# EAGLE design Triple Socket (EAGLE 8.4.0)
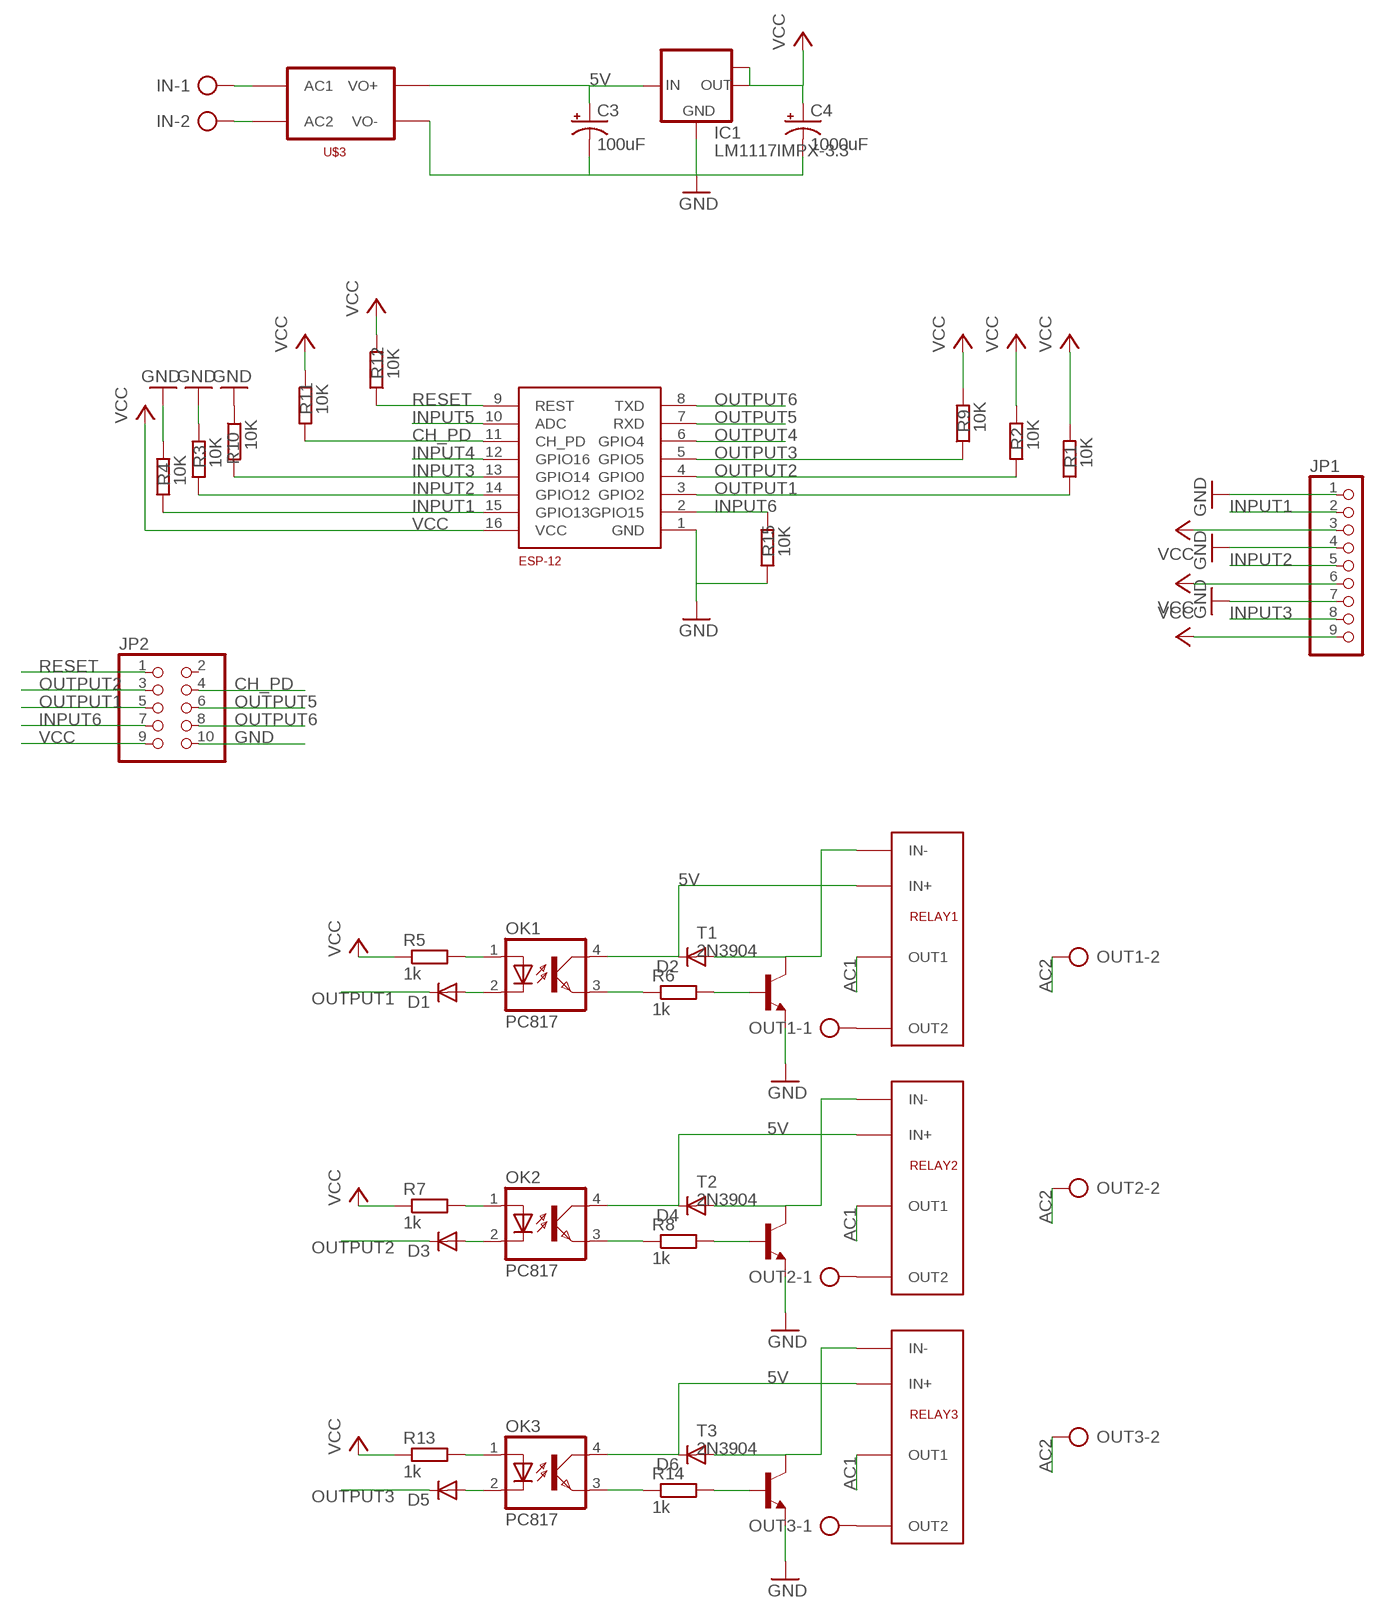
[diagram p0: schematic, sheet 1]

## Parts
C3  100uF  CPOL-USE5-10.5  [E5-10,5]
C4  1000uF  CPOL-USE5-10.5  [E5-10,5]
D1  DIODE-SOD80C  [SOD80C]
D2  DIODE-SOD80C  [SOD80C]
D3  DIODE-SOD80C  [SOD80C]
D4  DIODE-SOD80C  [SOD80C]
D5  DIODE-SOD80C  [SOD80C]
D6  DIODE-SOD80C  [SOD80C]
ESP-12  ESP8266_ESP-12  [ESP8266-ESP12]
IC1  LM1117IMPX-3.3  [SOT223]
IN  AK500/2-H  [AK500/2-H]
JP1  PINHD-1X9  [1X09]
JP2  PINHD-2X5  [2X05]
OK1  PC817  [DIL04]
OK2  PC817  [DIL04]
OK3  PC817  [DIL04]
OUT1  AK500/2-H  [AK500/2-H]
OUT2  AK500/2-H  [AK500/2-H]
OUT3  AK500/2-H  [AK500/2-H]
R1  10K  R-EU_R0805  [R0805]
R2  10K  R-EU_R0805  [R0805]
R3  10K  R-EU_R0805  [R0805]
R4  10K  R-EU_R0805  [R0805]
R5  1k  R-EU_R0805  [R0805]
R6  1k  R-EU_R0805  [R0805]
R7  1k  R-EU_R0805  [R0805]
R8  1k  R-EU_R0805  [R0805]
R9  10K  R-EU_R0805  [R0805]
R10  10K  R-EU_R0805  [R0805]
R11  10K  R-EU_R0805  [R0805]
R12  10K  R-EU_R0805  [R0805]
R13  1k  R-EU_R0805  [R0805]
R14  1k  R-EU_R0805  [R0805]
R15  10K  R-EU_R0805  [R0805]
RELAY1  G3MB-202P  [G3MB-202P]
RELAY2  G3MB-202P  [G3MB-202P]
RELAY3  G3MB-202P  [G3MB-202P]
T1  2N3904  [TO92]
T2  2N3904  [TO92]
T3  2N3904  [TO92]
U$3  HLK-PM01  [HLK-PM01]

## Nets
5V [Power]: C3.+ D2.C D4.C D6.C IC1.3(IN) OK1.4(COL) OK2.4(COL) OK3.4(COL) RELAY1.IN+ RELAY2.IN+ RELAY3.IN+ U$3.VO+
AC1 [AC]: IN.1 RELAY1.OUT1 RELAY2.OUT1 RELAY3.OUT1 U$3.AC1
AC2 [AC]: IN.2 OUT1.2 OUT2.2 OUT3.2 U$3.AC2
CH_PD: ESP-12.11(CH_PD) JP2.4 R11.1
GND [Power]: C3.- C4.- ESP-12.1(GND) IC1.1(GND) JP1.1 JP1.4 JP1.7 JP2.10 R3.1 R4.2 R10.1 R15.1 T1.3(E) T2.3(E) T3.3(E) U$3.VO-
INPUT1: ESP-12.15(GPIO13) JP1.2 R4.1
INPUT2: ESP-12.14(GPIO12) JP1.5 R3.2
INPUT3: ESP-12.13(GPIO14) JP1.8 R10.2
INPUT4: ESP-12.12(GPIO16)
INPUT5: ESP-12.10(ADC)
INPUT6: ESP-12.2(GPIO15) JP2.7 R15.2
N$1: OUT2.1 RELAY2.OUT2
N$3: R14.2 T3.2(B)
N$4: D6.A RELAY3.IN- T3.1(C)
N$5: OUT1.1 RELAY1.OUT2
N$6: OUT3.1 RELAY3.OUT2
N$7: R6.2 T1.2(B)
N$8: D2.A RELAY1.IN- T1.1(C)
N$12: R8.2 T2.2(B)
N$13: D4.A RELAY2.IN- T2.1(C)
OPT_EMITTER1: OK1.3(EMIT) R6.1
OPT_EMITTER3: OK3.3(EMIT) R14.1
OPT_LED-1: D1.A OK1.2(C)
OPT_LED-3: D5.A OK3.2(C)
OPTO_EMITTER2: OK2.3(EMIT) R8.1
OPTO_LED+1: OK1.1(A) R5.2
OPTO_LED+2: OK2.1(A) R7.2
OPTO_LED+3: OK3.1(A) R13.2
OPTO_LED-2: D3.A OK2.2(C)
OUTPUT1: D1.C ESP-12.3(GPIO2) JP2.5 R1.1
OUTPUT2: D3.C ESP-12.4(GPIO0) JP2.3 R2.1
OUTPUT3: D5.C ESP-12.5(GPIO5) R9.1
OUTPUT4: ESP-12.6(GPIO4)
OUTPUT5: ESP-12.7(RXD) JP2.6
OUTPUT6: ESP-12.8(TXD) JP2.8
RESET: ESP-12.9(REST) JP2.1 R12.1
VCC [Power]: C4.+ ESP-12.16(VCC) IC1.2(OUT) IC1.TAB(OUT1) JP1.3 JP1.6 JP1.9 JP2.9 R1.2 R2.2 R5.1 R7.1 R9.2 R11.2 R12.2 R13.1
Unconnected: JP2.2

## Library data of the parts
C3 C4 = rcl:CPOL-US: POLARIZED CAPACITOR, American symbol
D1-D6 = diode:DIODE-: DIODE
ESP-12 = ESP8266-ESP12:ESP8266_ESP-12
IC1 = lm1117:LM1117IMPX-*
IN OUT1-OUT3 = con-ptr500:AK500/2-H: CONNECTOR Aug. 2004 / PTR Meßtechnik: Die Bezeichnung der Serie AK505 wurde geändert. Es handelt sich hierbei um AK500 in horizontaler Ausführung.
JP1 = pinhead:PINHD-1X9: PIN HEADER
JP2 = pinhead:PINHD-2X5: PIN HEADER
OK1-OK3 = optocoupler:PC817: SHARP OPTO COUPLER; MPN: PC817X4J000F; OC_FARNELL: 9707727; OC_NEWARK: 97K7059
R1-R15 = rcl:R-EU_: RESISTOR, European symbol
RELAY1-RELAY3 = AndreBotelho:G3MB-202P
T1-T3 = transistor:2N3904: NPN TRANSISTOR
U$3 = AndreBotelho:HLK-PM01

## Net classes
0 default: width 0.203 mm, drill 0.381 mm, clearance 0.152 mm
1 Power: width 0.254 mm, drill 0.381 mm, clearance 0.152 mm
2 AC: width 2.286 mm, drill 1.016 mm, clearance 0.305 mm

## Board
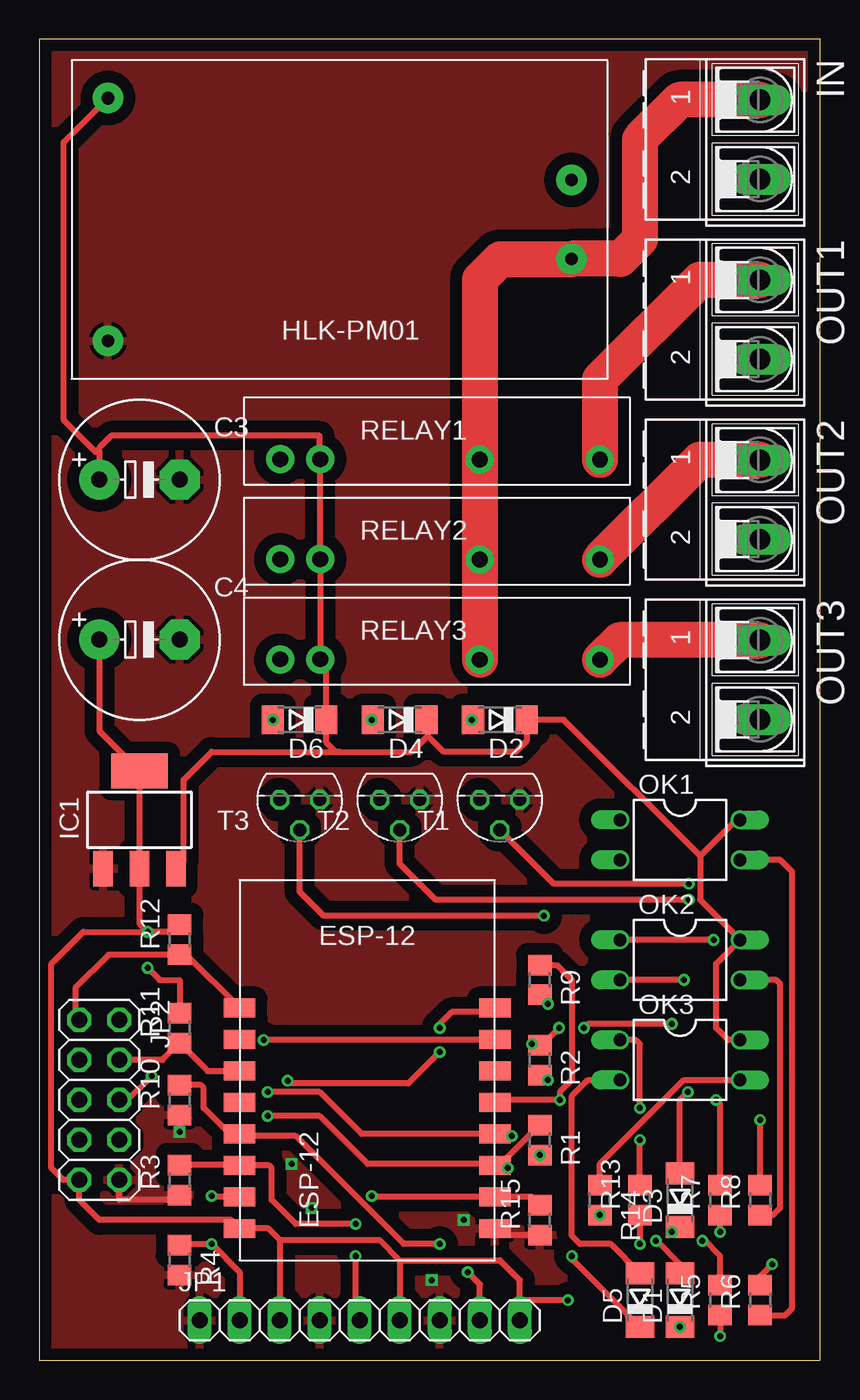
[diagram p1: board, top side]
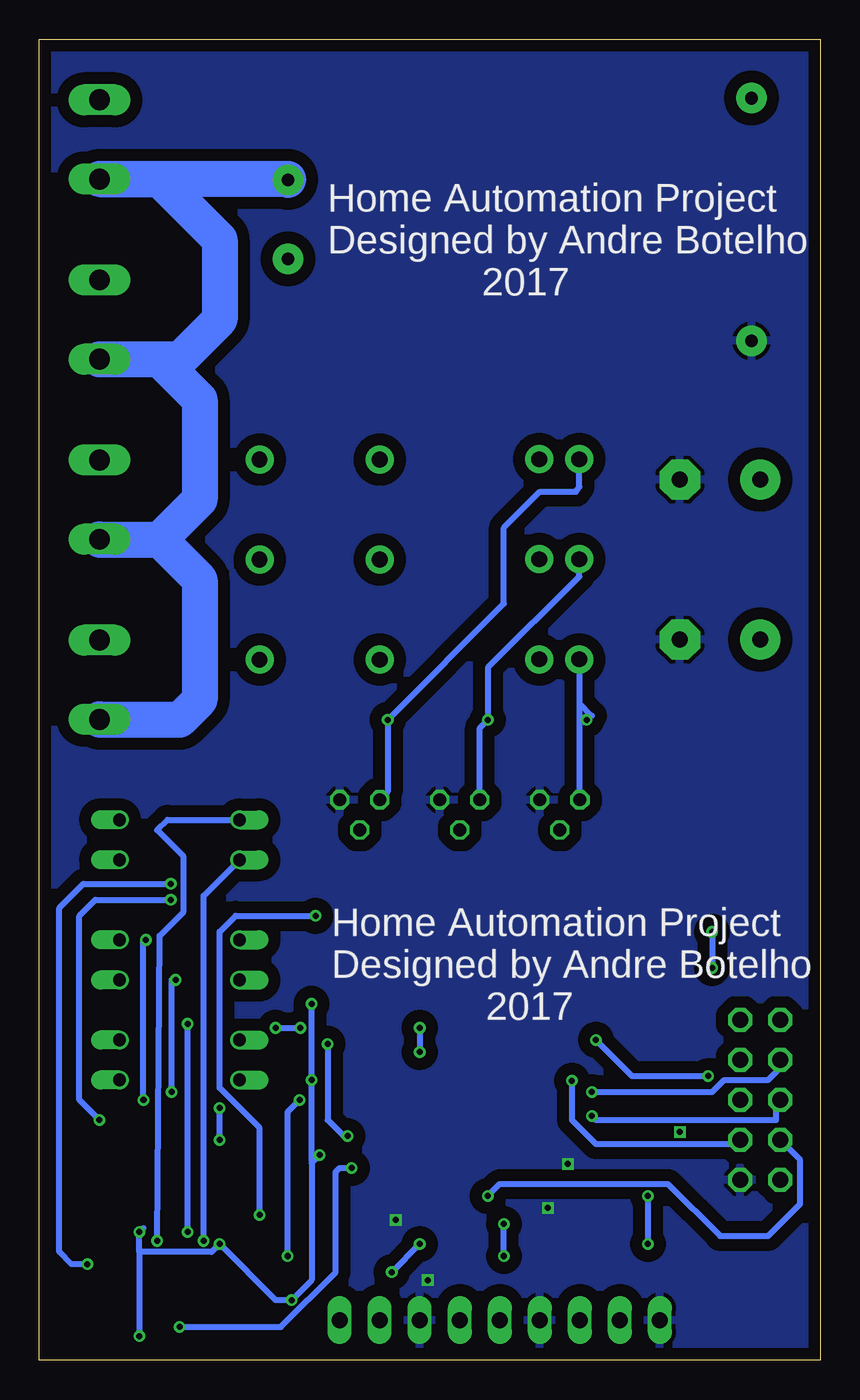
[diagram p2: board, bottom side, seen from below]

Size 49.53 x 83.82 mm. Coordinates in mm from the lower left corner, seen from the top.
Outline: 0,0 49.53,0 49.53,83.82 0,83.82 0,0
Copper layers (1*16): Top 0.0356mm / dielectric 1.5011mm / Bottom 0.0356mm
Design rules "oshpark-2layer": minimum track width 6mil, minimum drill 13mil, track to track 6mil, track to pad 6mil, pad to pad 6mil, via to via 6mil, smd to smd 6mil, copper to edge 15mil, drill to drill 6mil, minimum pad ring 7mil, minimum via ring 7mil, stop-mask expansion 2.5mil, vias tented up to drill 0mil, thermal gap 10mil

### Footprints (pad centres in the part's own frame; a part is rotated, then mirrored left to right if it is on the bottom)
E5-10,5 = drill 1.016 pad 2.54: + -2.54,0 | drill 1.016 pad 2.54 octagon: - 2.54,0
SOD80C = smd 1.4 x 1.8: A 1.7,0; C -1.7,0
ESP8266-ESP12 = smd 2 x 1.2: 1 8.58,-9.43; 2 8.58,-7.43; 3 8.58,-5.43; 4 8.58,-3.43; 5 8.58,-1.43; 6 8.58,0.57; 7 8.58,2.57; 8 8.58,4.57; 9 -7.62,4.57; 10 -7.62,2.57; 11 -7.62,0.57; 12 -7.62,-1.43; 13 -7.62,-3.43; 14 -7.62,-5.43; 15 -7.62,-7.43; 16 -7.62,-9.43
SOT223 = smd 1.219 x 2.235: 1 -2.311,-3.099; 2 0,-3.099; 3 2.311,-3.099 | smd 3.6 x 2.2: TAB 0,3.099
AK500/2-H = drill 1.321 long: 1 -2.515,0; 2 2.515,0
1X09 = drill 1.016 long: 1 -10.16,0; 2 -7.62,0; 3 -5.08,0; 4 -2.54,0; 5 0,0; 6 2.54,0; 7 5.08,0; 8 7.62,0; 9 10.16,0
2X05 = drill 1.016 octagon: 1 -5.08,-1.27; 2 -5.08,1.27; 3 -2.54,-1.27; 4 -2.54,1.27; 5 0,-1.27; 6 0,1.27; 7 2.54,-1.27; 8 2.54,1.27; 9 5.08,-1.27; 10 5.08,1.27
DIL04 = drill 0.813 offset: 1 -1.27,-3.81; 2 1.27,-3.81; 3 1.27,3.81; 4 -1.27,3.81
R0805 = smd 1.3 x 1.5: 1 -0.95,0; 2 0.95,0
G3MB-202P = drill 1 pad 1.778: IN+ -6.311,-1.245; IN- -8.851,-1.245; OUT1 3.81,-1.27; OUT2 11.43,-1.27
TO92 = drill 0.813 octagon: 1 1.27,0; 2 0,1.905; 3 -1.27,0
HLK-PM01 = drill 0.8 pad 1.93: AC1 -14.7,2.5; AC2 -14.7,-2.5; VO+ 14.7,-7.7; VO- 14.7,7.7

### Placement (x,y rotation side)
C3  6.35,55.88 0 top
C4  6.35,45.72 0 top
D1  40.64,3.81 90 top
D2  29.21,40.64 180 top
D3  40.64,10.16 90 top
D4  22.86,40.64 180 top
D5  38.1,3.81 90 top
D6  16.51,40.64 180 top
ESP-12  20.32,17.78 0 top
IC1  6.35,34.29 0 top
IN  45.72,77.47 270 top
JP1  20.32,2.54 0 top
JP2  3.81,16.51 270 top
OK1  40.64,33.02 270 top
OK2  40.64,25.4 270 top
OK3  40.64,19.05 270 top
OUT1  45.72,66.04 270 top
OUT2  45.72,54.61 270 top
OUT3  45.72,43.18 270 top
R1  31.75,13.97 270 top
R2  31.75,19.05 270 top
R3  8.89,11.43 90 top
R4  8.89,6.35 270 top
R5  43.18,3.81 90 top
R6  45.72,3.81 90 top
R7  43.18,10.16 90 top
R8  45.72,10.16 90 top
R9  31.75,24.13 270 top
R10  8.89,16.51 90 top
R11  8.89,21.08 90 top
R12  8.89,26.67 90 top
R13  38.1,10.16 90 top
R14  35.56,10.16 270 top
R15  31.75,8.89 90 top
RELAY1  24.13,58.42 0 top
RELAY2  24.13,52.07 0 top
RELAY3  24.13,45.72 0 top
T1  29.21,35.56 180 top
T2  22.86,35.56 180 top
T3  16.51,35.56 180 top
U$3  19.05,72.39 180 top

### Tracks (layer width: path | path; a pad name or v marks a point on that pad's centre or on a via)
5V
  Top 0.381: OK3.4 43.69,20.32 42.93,21.08 42.93,25.15 OK2.4 41.91,29.21 41.91,32 | OK1.4 44.2,34.29 41.91,32 | 41.91,32 33.27,40.64 D2.C 30.91,39.29 30.23,38.61 25.65,38.61 24.64,39.62 | D4.C 24.64,40.56 24.64,39.62 | 24.64,39.62 23.62,38.61 19.05,38.61 | 19.05,38.61 18.8,38.61 18.21,39.19 D6.C 18.21,44.09 RELAY3.IN+ 17.82,50.55 | 17.82,50.55 RELAY2.IN+ | 17.82,50.55 RELAY1.IN+ 17.78,57.22 17.78,58.67 4.57,58.67 3.81,57.91 3.81,57.66 | 3.81,57.66 C3.+ | U$3.VO+ 1.52,77.26 1.52,59.69 3.56,57.66 3.81,57.66 | IC1.3 9.14,31.67 9.14,36.83 10.92,38.61 19.05,38.61
AC1
  Top 2.286: IN.1 40.62,79.98 38.1,77.47 38.1,71.12 36.87,69.89 U$3.AC1 33.71,69.85 29.21,69.85 27.94,68.58 RELAY1.OUT1 RELAY2.OUT1 RELAY3.OUT1
AC2
  Bottom 2.286: U$3.AC2 33.75,74.95 IN.2 41.94,74.95 38.1,71.12 38.1,66.04 40.64,63.5 45.72,63.5 OUT1.2 41.94,63.52 39.37,60.96 39.37,54.61 41.91,52.07 | OUT2.2 45.7,52.07 41.91,52.07 | 41.91,52.07 39.37,49.53 39.37,41.91 40.64,40.64 45.7,40.64 OUT3.2
CH_PD
  Top 0.381: JP2.4 7.81,19.05 R11.1 10.67,18.35 ESP-12.11
GND  (via drill 0.38)
  Top 0.381: ESP-12.1 29.31,7.94 R15.1 | R3.1 8.57,10.16 5.08,10.16 JP2.10 | R10.1 v8.89,14.48
  other vias: 16,12.45 17.27,9.65 24.89,5.08 26.92,8.89
  pour Top (isolate 0.762): 0,0 0,83.82 49.53,83.82 49.53,0
  pour Bottom (isolate 0.762): 0,0 0,83.82 49.53,83.82 49.53,0
INPUT1  (via drill 0.38)
  Top 0.381: ESP-12.15 10.99,10.35 v10.92,10.41 | R4.1 8.96,7.37 v10.92,7.37 12.7,5.59 JP1.2
  Bottom 0.381: v10.92,10.41 v10.92,7.37
INPUT2  (via drill 0.38)
  Top 0.381: JP1.5 20.07,2.79 v20.07,6.6 | v20.07,8.64 16.26,8.64 14.73,10.16 14.73,12.19 14.57,12.35 ESP-12.14 12.67,12.38 R3.2
  Bottom 0.381: v20.07,6.6 v20.07,8.64
INPUT3  (via drill 0.38)
  Top 0.381: R10.2 10.23,17.46 10.41,17.27 10.41,16 12.07,14.35 ESP-12.13 13.08,14.35 13.21,14.22 16.26,14.22 23.11,7.37 v25.4,7.37 | JP1.8 27.94,4.83 v27.18,5.59
  Bottom 0.381: v27.18,5.59 v25.4,7.37
INPUT6  (via drill 0.38)
  Top 0.381: R15.2 31.24,10.35 ESP-12.2 21.4,10.35 21.34,10.41 v21.08,10.41
  Bottom 0.381: v21.08,10.41 20.32,11.18 9.65,11.18 6.35,7.87 3.3,7.87 1.27,9.91 1.27,12.7 JP2.7
N$1
  Top 2.286: OUT2.1 41.88,57.12 RELAY2.OUT2
N$3  (via drill 0.38)
  Top 0.381: v32,28.19 18.03,28.19 16.51,29.72 T3.2
  Bottom 0.381: R14.2 35.56,14.73 38.1,17.27 38.1,27.18 37.08,28.19 v32,28.19
  other vias: 35.56,9.21
N$4  (via drill 0.38)
  Bottom 0.381: T3.1 15.24,44.44 RELAY3.IN- 15.28,41.7 14.48,40.89 14.56,40.89 D6.A
  other vias: 14.81,40.64
N$5
  Top 2.286: OUT1.1 41.88,68.56 35.56,62.23 RELAY1.OUT2
N$6
  Top 2.286: OUT3.1 36.8,45.7 RELAY3.OUT2
N$7  (via drill 0.38)
  Top 0.381: R6.2 45.72,5.33 v46.48,6.1 | v41.2,30.23 32.64,30.23 T1.2
  Bottom 0.381: v46.48,6.1 47.5,6.1 48.26,6.86 48.26,28.7 46.74,30.23 v41.2,30.23 | v41.2,30.23 41.15,30.23 v41.2,30.23
N$8  (via drill 0.38)
  Top 0.381: D2.A v27.43,40.64
  Bottom 0.381: T1.1 27.43,36.07 v27.43,40.64 20.07,48.01 20.07,52.83 17.78,55.12 15.49,55.12 15.28,55.41 RELAY1.IN-
N$12  (via drill 0.38)
  Top 0.381: R8.2 v45.72,15.24 | v41.2,29.21 25.15,29.21 22.86,31.5 T2.2
  Bottom 0.381: v45.72,15.24 46.99,16.51 46.99,28.19 45.97,29.21 v41.2,29.21 | v41.2,29.21 41.15,29.21 v41.2,29.21
N$13  (via drill 0.38)
  Top 0.381: D4.A 21.16,41.07 21.08,41.15 21.08,40.72 D4.A | D4.A v21.08,40.64
  Bottom 0.381: T2.1 21.59,40.13 v21.08,40.64 21.08,43.94 15.28,49.74 RELAY2.IN-
OPT_EMITTER1
  Top 0.381: R6.1 47.31,2.86 47.75,3.3 47.75,30.99 46.99,31.75 OK1.3
OPT_EMITTER3
  Top 0.381: R14.1 35.56,12.45 40.89,17.78 OK3.3
OPT_LED-1  (via drill 0.38)
  Top 0.381: D1.A 40.64,6.1 39.12,7.62 v39.12,7.57
  Bottom 0.381: v39.12,7.57 39.12,29.46 OK1.2
OPT_LED-3
  Top 0.381: D5.A 36.24,7.37 34.29,7.37 33.78,7.87 33.78,16.76 34.8,17.78 OK3.2
OPTO_EMITTER2
  Top 0.381: R8.1 46.55,9.21 46.99,9.65 46.99,23.88 46.74,24.13 OK2.3
OPTO_LED+1  (via drill 0.38)
  Top 0.381: R5.2 43.18,6.6 42.16,7.62 42.11,7.57 v42.06,7.57
  Bottom 0.381: v42.06,7.57 41.91,26.92 40.39,28.45 40.39,31.96 42.06,33.63 41.4,34.29 OK1.1
OPTO_LED+2  (via drill 0.38)
  Top 0.381: R7.2 43.18,16.26 v42.93,16.51 | v42.77,26.67 OK2.1
  Bottom 0.381: v42.93,16.51 42.93,26.67 v42.77,26.67
OPTO_LED+3  (via drill 0.38)
  Top 0.381: R13.2 v38.1,13.97 | v38.1,16 38.1,20.07 37.85,20.32 OK3.1
  Bottom 0.381: v38.1,13.97 v38.1,16
OPTO_LED-2  (via drill 0.38)
  Top 0.381: D3.A 40.64,16.51 v41.15,17.02 | v40.89,24.13 OK2.2
  Bottom 0.381: v41.15,17.02 41.15,24.13 v40.89,24.13
OUTPUT1  (via drill 0.38)
  Top 0.381: 29.37,12.54 R1.1 | 29.37,12.54 29.18,12.35 ESP-12.3 28.8,12.45 20.83,12.45 17.78,15.49 v14.48,15.49 | v29.72,12.19 29.37,12.54
  Bottom 0.381: D1.C 34.21,2.11 30.73,5.59 30.73,11.94 30.48,12.19 v29.72,12.19 | v14.48,15.49 14.22,15.24 2.79,15.24 2.79,16.26 JP2.5
  other vias: 40.64,2.11
OUTPUT2  (via drill 0.38)
  Top 0.381: v31.24,20.07 31.31,20 R2.1 31.89,20 v32.97,21.08 | v29.97,14.22 29.85,14.35 ESP-12.4 20.45,14.35 17.78,17.02 v14.48,17.02 | D3.C 40.46,8.46 v40.13,8.13 | v40.13,21.34 34.8,21.34 v34.54,21.08
  Bottom 0.381: v31.24,20.07 31.24,15.24 30.23,14.22 v29.97,14.22 | v40.13,8.13 v40.13,21.34 | v34.54,21.08 v32.97,21.08 | v14.48,17.02 6.86,17.02 6.1,17.78 3.3,17.78 2.54,18.54 JP2.3
OUTPUT3  (via drill 0.38)
  Top 0.381: D5.C 33.86,6.35 33.78,6.35 v33.78,6.6 | ESP-12.5 29.06,16.51 v33.02,16.51 33.02,17.02 33.78,17.78 33.78,24.13 32.83,25.08 R9.1
  Bottom 0.381: v33.78,6.6 33.78,15.75 v33.02,16.51
OUTPUT5  (via drill 0.38)
  Top 0.381: ESP-12.7 28.87,20.32 v14.22,20.32 | v7.11,18.03 5.59,16.51 JP2.6
  Bottom 0.381: v14.22,20.32 11.94,18.03 v7.11,18.03
OUTPUT6  (via drill 0.38)
  Top 0.381: ESP-12.8 28.65,22.1 26.16,22.1 25.4,21.34 v25.4,21.08 | v25.4,19.56 23.39,17.55 15.75,17.55 v15.75,17.73
  Bottom 0.381: v25.4,21.08 v25.4,19.56 | v15.75,17.73 15.75,15.24 14.22,13.72 5.33,13.72 JP2.8
RESET
  Top 0.381: ESP-12.9 9.33,25.72 R12.1 4.38,25.72 2.29,23.62 2.29,21.84 JP2.1
VCC  (via drill 0.38)
  Top 0.381: 15.24,7.62 14.51,8.35 ESP-12.16 12.16,8.89 3.81,8.89 2.54,10.16 JP2.9 1.52,11.43 0.76,12.19 0.76,25.15 2.79,27.18 v6.86,27.18 | 15.24,7.62 JP1.3 | 15.24,7.62 21.59,7.62 22.86,6.35 | 22.86,6.35 JP1.6 | 22.86,6.35 29.21,6.35 30.48,5.08 30.48,3.81 | 30.48,3.81 JP1.9 | R12.2 8.45,27.18 v6.86,27.18 | v6.86,27.18 6.35,27.69 IC1.2 IC1.TAB 3.81,39.93 C4.+ | v6.86,24.89 7.62,24.13 8.89,24.13 R11.2 | R5.1 v43.18,1.52 | v43.18,8.13 R7.1 | 38.1,8.38 R13.1 v38.1,7.37 | R2.2 31.94,18.1 v32.26,17.78 | v32.26,22.61 31.75,23.11 R9.2 | v33.53,3.81 30.48,3.81
  Bottom 0.381: v6.86,27.18 v6.86,24.89 | 43.18,6.86 v43.18,1.52 | 43.18,6.86 v43.18,8.13 42.93,8.38 | 43.18,6.86 38.61,6.86 v38.1,7.37 34.54,3.81 v33.53,3.81 32.26,5.08 32.26,12.51 R1.2 32.07,12.7 32.26,12.7 v32.26,17.78 v32.26,22.61
  other vias: 31.75,13.02

### Text on the board
bPlace: Home Automation Project / Designed by Andre Botelho / 2017 | Home Automation Project / Designed by Andre Botelho / 2017